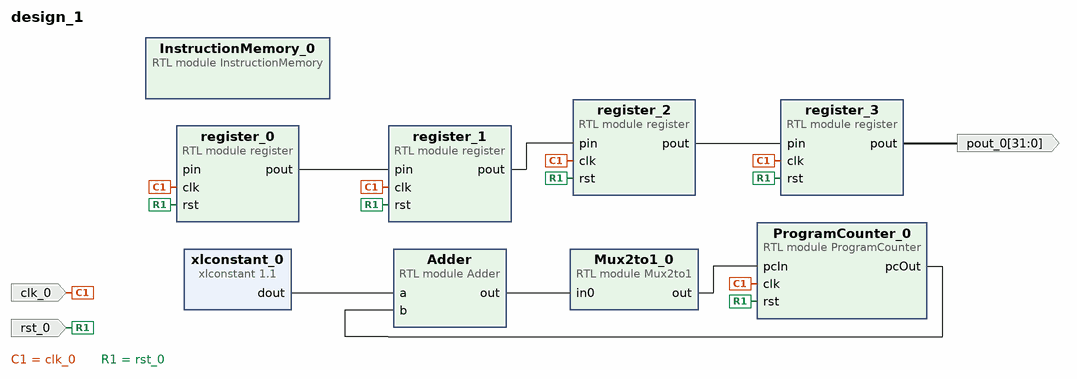
[diagram p0: block diagram of the top level]
# Vivado block design design_1, xc7z010clg400-1, Vivado 2018.3
create_bd_design design_1

create_bd_port -dir I -type clk clk_0
create_bd_port -dir I -type rst rst_0
create_bd_port -dir O -from 31 -to 0 pout_0

create_bd_cell -type ip -vlnv xilinx.com:ip:xlconstant:1.1 xlconstant_0
set_property -dict {CONFIG.CONST_VAL 4 CONFIG.CONST_WIDTH 32} [get_bd_cells xlconstant_0]
create_bd_cell -type module -reference Adder Adder
create_bd_cell -type module -reference register register_0
create_bd_cell -type module -reference register register_1
create_bd_cell -type module -reference register register_2
create_bd_cell -type module -reference register register_3
create_bd_cell -type module -reference ProgramCounter ProgramCounter_0
create_bd_cell -type module -reference Mux2to1 Mux2to1_0
create_bd_cell -type module -reference InstructionMemory InstructionMemory_0

# ---- connections ----

connect_bd_net [get_bd_pins xlconstant_0/dout] [get_bd_pins Adder/a]
connect_bd_net -net clk_0_1 [get_bd_ports clk_0] \
  [get_bd_pins register_0/clk] [get_bd_pins register_2/clk] [get_bd_pins register_1/clk] [get_bd_pins register_3/clk] \
  [get_bd_pins ProgramCounter_0/clk]
connect_bd_net -net rst_0_1 [get_bd_ports rst_0] \
  [get_bd_pins register_0/rst] [get_bd_pins register_2/rst] [get_bd_pins register_1/rst] [get_bd_pins register_3/rst] \
  [get_bd_pins ProgramCounter_0/rst]
connect_bd_net [get_bd_pins register_3/pout] [get_bd_ports pout_0]
connect_bd_net [get_bd_pins register_0/pout] [get_bd_pins register_1/pin]
connect_bd_net [get_bd_pins register_1/pout] [get_bd_pins register_2/pin]
connect_bd_net [get_bd_pins register_2/pout] [get_bd_pins register_3/pin]
# net InstructionMemory_0_mem has one end: register_0/pin
connect_bd_net [get_bd_pins ProgramCounter_0/pcOut] [get_bd_pins Adder/b]
connect_bd_net [get_bd_pins Mux2to1_0/out] [get_bd_pins ProgramCounter_0/pcIn]
connect_bd_net -net AdderIf_out [get_bd_pins Adder/out] [get_bd_pins Mux2to1_0/in0]

validate_bd_design
save_bd_design
